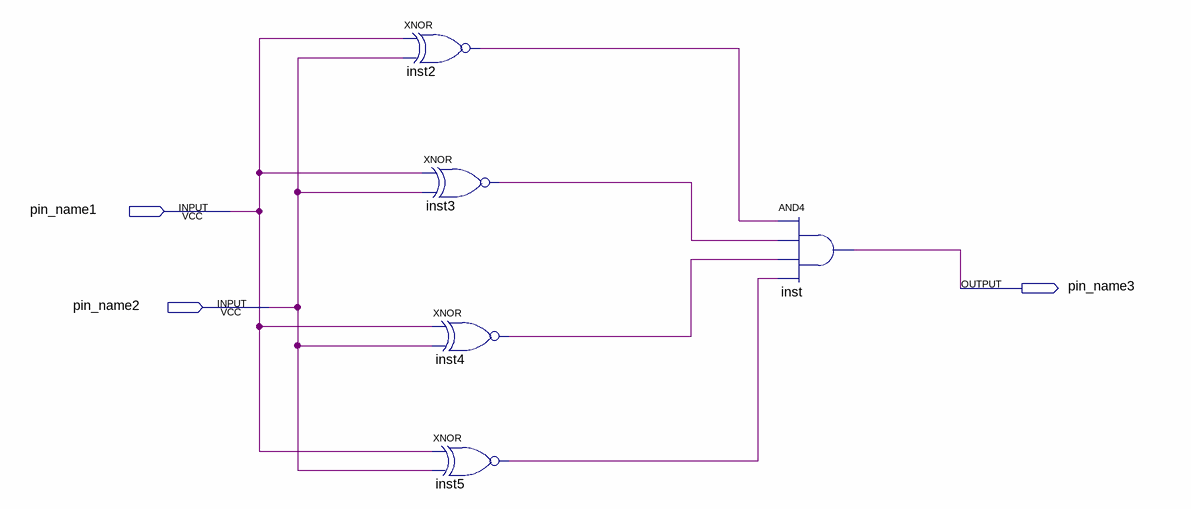
[diagram p0: schematic sheet]
// Quartus schematic EqCmpDemo.bdf as structural Verilog: 5 symbols, 3 pins
module EqCmpDemo (
  input  pin_name1,
  input  pin_name2,
  output pin_name3
);

  wire inst2_out, inst3_out, inst4_out, inst5_out;

  xnor inst2 (inst2_out, pin_name1, pin_name2);
  xnor inst3 (inst3_out, pin_name1, pin_name2);
  xnor inst4 (inst4_out, pin_name1, pin_name2);
  xnor inst5 (inst5_out, pin_name1, pin_name2);
  and inst (pin_name3, inst2_out, inst3_out, inst4_out, inst5_out);
endmodule
